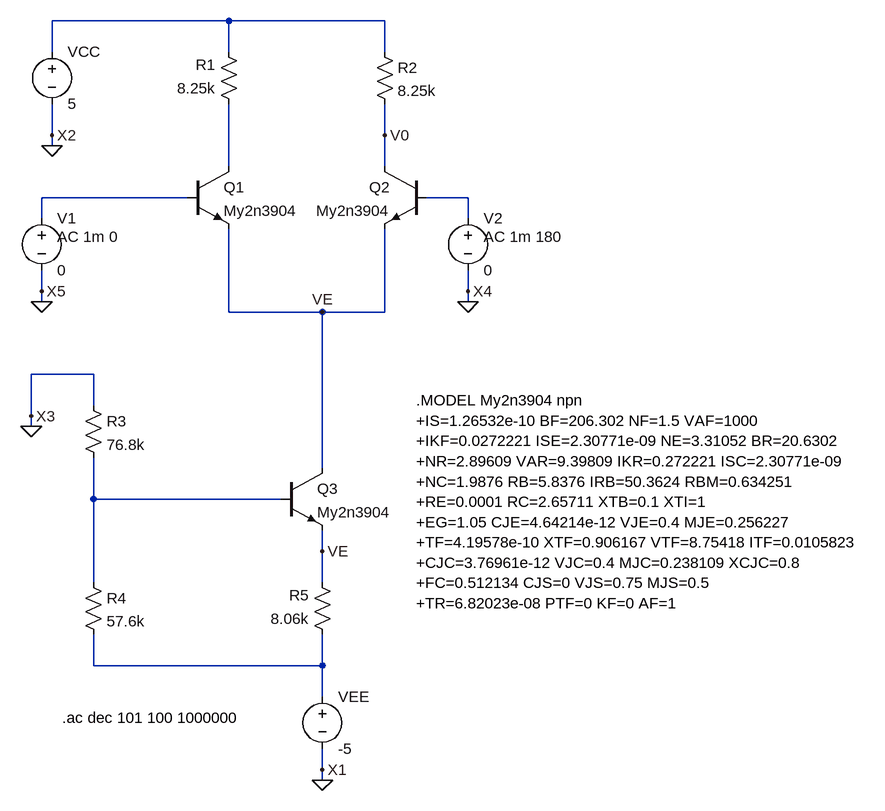
[diagram p0: schematic project2_p3.asc]
project2_p3.asc, the LTspice schematic file:
Version 4
SHEET 1 1432 700
WIRE 144 -592 -128 -592
WIRE 384 -592 144 -592
WIRE -128 -544 -128 -592
WIRE 144 -544 144 -592
WIRE 384 -544 384 -592
WIRE -128 -416 -128 -464
WIRE 384 -416 384 -464
WIRE -128 -400 -128 -416
WIRE 144 -368 144 -464
WIRE 384 -368 384 -416
WIRE 80 -320 -144 -320
WIRE 512 -320 448 -320
WIRE -144 -288 -144 -320
WIRE 512 -288 512 -320
WIRE -144 -176 -144 -208
WIRE 512 -176 512 -208
WIRE -144 -160 -144 -176
WIRE 512 -160 512 -176
WIRE 144 -144 144 -272
WIRE 288 -144 144 -144
WIRE 384 -144 384 -272
WIRE 384 -144 288 -144
WIRE -64 -48 -160 -48
WIRE -64 0 -64 -48
WIRE -160 16 -160 -48
WIRE -160 32 -160 16
WIRE 288 96 288 -144
WIRE -64 144 -64 80
WIRE 224 144 -64 144
WIRE 288 224 288 192
WIRE -64 272 -64 144
WIRE 288 272 288 224
WIRE -64 400 -64 352
WIRE 288 400 288 352
WIRE 288 400 -64 400
WIRE 288 448 288 400
WIRE 288 560 288 528
WIRE 288 576 288 560
FLAG -160 32 0
FLAG -128 -400 0
FLAG 288 576 0
FLAG 288 560 X1
FLAG -160 16 X3
FLAG -128 -416 X2
FLAG 288 224 VE
FLAG -144 -160 0
FLAG -144 -176 X5
FLAG 384 -416 V0
FLAG 288 -144 VE
FLAG 512 -160 0
FLAG 512 -176 X4
SYMBOL npn 224 96 R0
SYMATTR InstName Q3
SYMATTR Value My2n3904
SYMBOL voltage 288 432 R0
WINDOW 123 0 0 Left 0
WINDOW 39 0 0 Left 0
SYMATTR InstName VEE
SYMATTR Value -5
SYMBOL voltage -128 -560 R0
WINDOW 123 0 0 Left 0
WINDOW 39 0 0 Left 0
SYMATTR InstName VCC
SYMATTR Value 5
SYMBOL res 304 368 R180
WINDOW 0 36 76 Left 2
WINDOW 3 36 40 Left 2
SYMATTR InstName R5
SYMATTR Value 8.06k
SYMBOL res -80 256 R0
SYMATTR InstName R4
SYMATTR Value 57.6k
SYMBOL res -80 -16 R0
SYMATTR InstName R3
SYMATTR Value 76.8k
SYMBOL voltage -144 -304 R0
WINDOW 123 24 44 Left 2
WINDOW 39 0 0 Left 0
SYMATTR Value2 AC 1m 0
SYMATTR InstName V1
SYMATTR Value 0
SYMBOL npn 80 -368 R0
SYMATTR InstName Q1
SYMATTR Value My2n3904
SYMBOL npn 448 -368 M0
SYMATTR InstName Q2
SYMATTR Value My2n3904
SYMBOL res 160 -448 R180
WINDOW 0 36 76 Left 2
WINDOW 3 36 40 Left 2
SYMATTR InstName R1
SYMATTR Value 8.25k
SYMBOL res 368 -560 R0
SYMATTR InstName R2
SYMATTR Value 8.25k
SYMBOL voltage 512 -304 R0
WINDOW 123 24 44 Left 2
WINDOW 39 0 0 Left 0
SYMATTR Value2 AC 1m 180
SYMATTR InstName V2
SYMATTR Value 0
TEXT 432 -8 Left 2 !.MODEL My2n3904 npn\n+IS=1.26532e-10 BF=206.302 NF=1.5 VAF=1000\n+IKF=0.0272221 ISE=2.30771e-09 NE=3.31052 BR=20.6302\n+NR=2.89609 VAR=9.39809 IKR=0.272221 ISC=2.30771e-09\n+NC=1.9876 RB=5.8376 IRB=50.3624 RBM=0.634251\n+RE=0.0001 RC=2.65711 XTB=0.1 XTI=1\n+EG=1.05 CJE=4.64214e-12 VJE=0.4 MJE=0.256227\n+TF=4.19578e-10 XTF=0.906167 VTF=8.75418 ITF=0.0105823\n+CJC=3.76961e-12 VJC=0.4 MJC=0.238109 XCJC=0.8\n+FC=0.512134 CJS=0 VJS=0.75 MJS=0.5\n+TR=6.82023e-08 PTF=0 KF=0 AF=1
TEXT -112 480 Left 2 !.ac dec 101 100 1000000

The netlist it stands for:
* project2_p3.asc
Q3 VE N005 VE 0 My2n3904
VEE N006 0 -5
VCC N001 0 5
R5 N006 VE 8.06k
R4 N005 N006 57.6k
R3 0 N005 76.8k
V1 N003 0 0 AC 1m 0
Q1 N002 N003 VE 0 My2n3904
Q2 V0 N004 VE 0 My2n3904
R1 N002 N001 8.25k
R2 N001 V0 8.25k
V2 N004 0 0 AC 1m 180
.model NPN NPN
.model PNP PNP
.lib standard.bjt
.MODEL My2n3904 npn
+IS=1.26532e-10 BF=206.302 NF=1.5 VAF=1000
+IKF=0.0272221 ISE=2.30771e-09 NE=3.31052 BR=20.6302
+NR=2.89609 VAR=9.39809 IKR=0.272221 ISC=2.30771e-09
+NC=1.9876 RB=5.8376 IRB=50.3624 RBM=0.634251
+RE=0.0001 RC=2.65711 XTB=0.1 XTI=1
+EG=1.05 CJE=4.64214e-12 VJE=0.4 MJE=0.256227
+TF=4.19578e-10 XTF=0.906167 VTF=8.75418 ITF=0.0105823
+CJC=3.76961e-12 VJC=0.4 MJC=0.238109 XCJC=0.8
+FC=0.512134 CJS=0 VJS=0.75 MJS=0.5
+TR=6.82023e-08 PTF=0 KF=0 AF=1
.ac dec 101 100 1000000
.backanno
.end